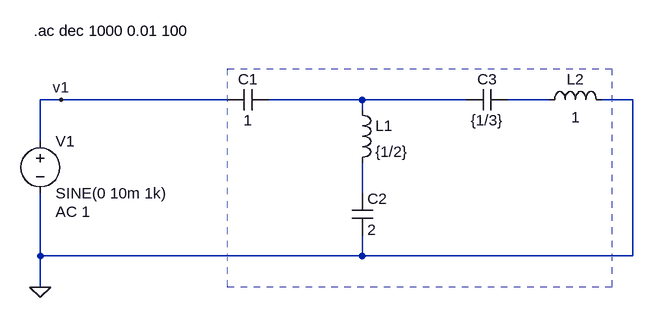
[diagram p0: schematic TS11a.asc]
TS11a.asc, the LTspice schematic file:
Version 4
SHEET 1 880 680
WIRE -192 128 -224 128
WIRE 64 128 -192 128
WIRE 272 128 128 128
WIRE 432 128 272 128
WIRE 560 128 496 128
WIRE 688 128 640 128
WIRE 272 144 272 128
WIRE -224 192 -224 128
WIRE 272 272 272 224
WIRE -224 368 -224 272
WIRE 272 368 272 336
WIRE 272 368 -224 368
WIRE 688 368 688 128
WIRE 688 368 272 368
WIRE -224 416 -224 368
FLAG -192 128 v1
FLAG -224 416 0
SYMBOL cap 128 112 R90
WINDOW 0 0 32 VBottom 2
WINDOW 3 32 32 VTop 2
SYMATTR InstName C1
SYMATTR Value 1
SYMBOL ind 256 128 R0
SYMATTR InstName L1
SYMATTR Value {1/2}
SYMBOL cap 256 272 R0
SYMATTR InstName C2
SYMATTR Value 2
SYMBOL cap 496 112 R90
WINDOW 0 0 32 VBottom 2
WINDOW 3 32 32 VTop 2
SYMATTR InstName C3
SYMATTR Value {1/3}
SYMBOL ind 544 144 R270
WINDOW 0 32 56 VTop 2
WINDOW 3 5 56 VBottom 2
SYMATTR InstName L2
SYMATTR Value 1
SYMBOL voltage -224 176 R0
WINDOW 123 24 124 Left 2
WINDOW 39 0 0 Left 0
SYMATTR InstName V1
SYMATTR Value SINE(0 10m 1k)
SYMATTR Value2 AC 1
TEXT -234 22 Left 2 !.ac dec 1000 0.01 100
RECTANGLE Normal 656 416 64 80 2

The netlist it stands for:
* TS11a.asc
C1 N001 v1 1
L1 N001 N003 {1/2}
C2 N003 0 2
C3 N002 N001 {1/3}
L2 N002 0 1
V1 v1 0 SINE(0 10m 1k) AC 1
.ac dec 1000 0.01 100
.backanno
.end